# Altium schematic sheet Controller.SchDoc
size A4; SheetNumber: 6; SheetTotal: 6
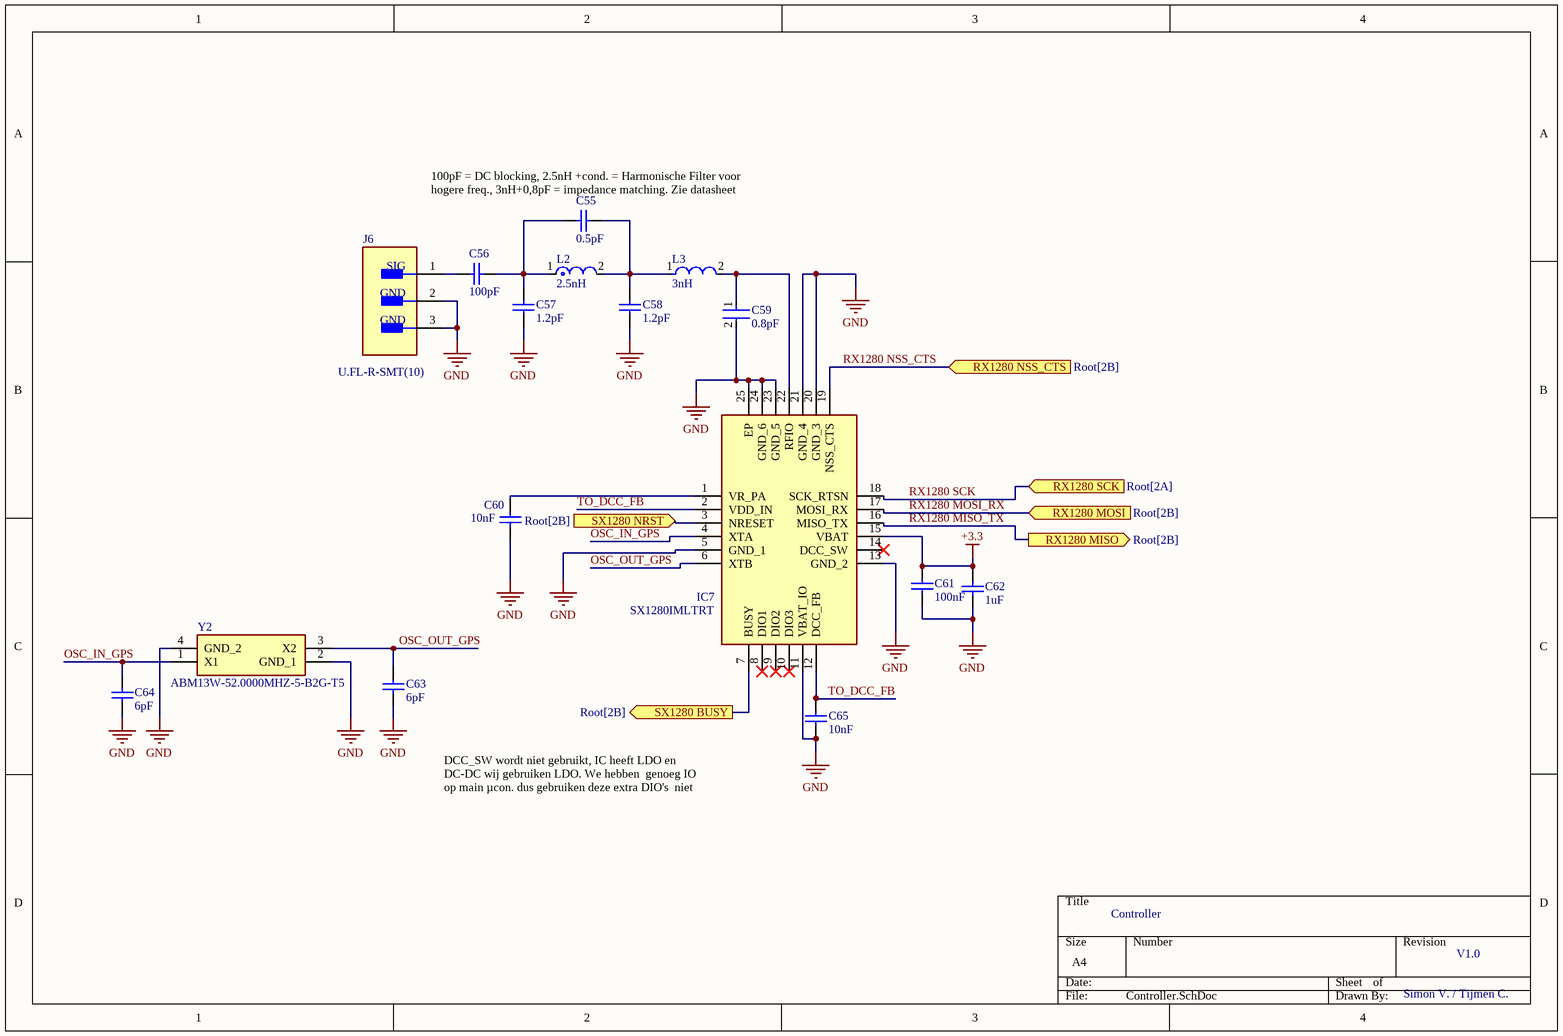
[diagram p0: Controller.SchDoc]

## Parts
C55  0.5pF  [CAPC0603(1608)100_M]
C56  100pF  [CAPC1608X92X38NL15T08]
C57  1.2pF  [CAPC1608X90X35NL15T15]
C58  1.2pF  [CAPC1608X90X35NL15T15]
C59  0.8pF  [FP-GCM188-0_1-IPC_C]
C60  10nF  [CAPC1608X92X38LL15T08]
C61  100nF  [CAPC1608X92X38ML15T08]
C62  1uF  [CAPC1608X90X35NL15T15]
C63  6pF  [CAPC1608X90X35ML15T15]
C64  6pF  [CAPC1608X90X35ML15T15]
C65  10nF  [CAPC1608X92X38LL15T08]
IC7  SX1280IMLTRT  [QFN50P400X400X100-25N-D]
J6  U.FL-R-SMT(10)  [FP-U_FL-R-SMT_10-MFG]
L2  2.5nH  [FP-LQP03TG_02-IPC_A]
L3  3nH  [FP-LQW18AN_80-MFG]
Y2  ABM13W-52.0000MHZ-5-B2G-T5  [ABM13W]

## Ports
RX1280 MISO (out, see Root[2B]), RX1280 MOSI (in, see Root[2B]), RX1280 NSS_CTS (in, see Root[2B]), RX1280 SCK (in, see Root[2A]), SX1280 BUSY (out, see Root[2B]), SX1280 NRST (in, see Root[2B])

## Nets
+3.3: C61.2 C62.2 IC7.15(VBAT)
GND: C57.1 C58.1 C59.2 C60.1 C61.1 C62.1 C63.1 C64.1 C65.1 IC7.5(GND_1) IC7.11(VBAT_IO) IC7.13(GND_2) IC7.20(GND_3) IC7.21(GND_4) IC7.23(GND_5) IC7.24(GND_6) IC7.25(EP) J6.2(GND) J6.3(GND) Y2.2(GND_1) Y2.4(GND_2)
OSC_IN_GPS: C64.2 IC7.4(XTA) Y2.1(X1)
OSC_OUT_GPS: C63.2 IC7.6(XTB) Y2.3(X2)
RX1280 MISO_TX: IC7.16(MISO_TX) ; port RX1280 MISO
RX1280 MOSI_RX: IC7.17(MOSI_RX) ; port RX1280 MOSI
RX1280 NSS_CTS: IC7.19(NSS_CTS) ; port RX1280 NSS_CTS
RX1280 SCK: IC7.18(SCK_RTSN) ; port RX1280 SCK
SX1280 BUSY: IC7.7(BUSY) ; port SX1280 BUSY
SX1280 NRST: IC7.3(NRESET) ; port SX1280 NRST
TO_DCC_FB: C65.2 IC7.2(VDD_IN) IC7.12(DCC_FB)
NetC55_1: C55.1 C56.2 C57.2 L2.1
NetC55_2: C55.2 C58.2 L2.2 L3.1
NetC56_1: C56.1 J6.1(SIG)
NetC59_1: C59.1 IC7.22(RFIO) L3.2
NetC60_2: C60.2 IC7.1(VR_PA)

Not connected (* = marked no-connect by the designer): IC7 8(DIO1)* 9(DIO2)* 10(DIO3)* 14(DCC_SW)*

## Notes on the sheet
- (near C55) 100pF = DC blocking, 2.5nH +cond. = Harmonische Filter voor hogere freq., 3nH+0,8pF = impedance matching. Zie datasheet
- DCC_SW wordt niet gebruikt, IC heeft LDO en  DC-DC wij gebruiken LDO. We hebben  genoeg IO op main µcon. dus gebruiken deze extra DIO's  niet
- Controller
- V1.0
- Simon V. / Tijmen C.

## Library data of the parts
C55 = CMP-1035-00001-1: CAP 0.5pF 10V ±0.1pF 0603 (1608 Metric) Thickness 1mm SMD; Case-EIA: 0603; Case-Metric: 1608; Tolerance: Â±0.1pF; Max Thickness: 1 mm; Value: 0.5pF; Technology: SMT; Rated Voltage: 10 V
C56 = CMP-2006-01145-1: Manufacturer: Vitramon; Part Number: VJ0603A101KXCAC
C57 C58 = CMP-2006-04009-1: Manufacturer: AVX Interconnect / Elco; Part Number: 06031A1R2CAT2A
C59 = CMP-06035-009191-1: Ceramic Capacitor for Automotive 0.8pF  ±0.1pF 100VDC C0G 0603 Paper T/R
C60 C65 = CMP-2006-01201-1: Manufacturer: Vitramon; Part Number: VJ0603Y103JXXAC
C61 = CMP-2006-01140-1: Part Number: VJ0603Y104MXXAC; Manufacturer: Vitramon
C62 = CMP-2006-04534-1: Part Number: 0603YD105MAT2A; Manufacturer: AVX Interconnect / Elco
C63 C64 = CMP-2006-04052-1: Part Number: 06031A5R0CAT2A; Manufacturer: AVX Interconnect / Elco
IC7 = SX1280IMLTRT: Integrated Circuit; Manufacturer_Name: SEMTECH; Datasheet Link: https://datasheet.datasheetarchive.com/originals/distributors/DKDS-37/728740.pdf; Height: 1mm; Manufacturer_Part_Number: SX1280IMLTRT; Mouser Part Number: 947-SX1280IMLTRT; Mouser Price/Stock: https://www.mouser.co.uk/ProductDetail/Semtech/SX1280IMLTRT?qs=5aG0NVq1C4xuoq8G6ZzdxQ%3D%3D; Arrow Part Number: SX1280IMLTRT; Arrow Price/Stock: https://www.arrow.com/en/products/sx1280imltrt/semtech?utm_currency=USD&region=nac
J6 = CMP-0029-00003-2: CONN U.FL RCPT STR 50 OHM SMD; Plating: Silver; Connector Type: Coaxial; Frequency: 6GHz; Impedance: 50R; Body Material: Bronze; Dielectric Material: Polymer; Contact Plating: Gold; Termination: Solder; Orientation: Vertical; Contact Material: Brass; Min Operating Temperature: -40°C; Mount: Surface Mount; Lead Free: Lead Free; Max Operating Temperature: 90°C; Radiation Hardening: No; Packaging: Tape and Reel; Body Plating: Silver; Fastening Type: Snap; Max Frequency: 6GHz; Depth: 3.1mm; Package Quantity: 1; Case/Package: SMD/SMT; Housing Color: Beige; Length: 3mm
L2 = CMP-06042-004686-1: Film type RF Inductor 2.5nH ±0.1nH 500mA 0.2Ω 0201 (0603); Self Resonant Frequency: 10GHz; Shielding: Unshielded; Core Material: Non-Magnetic; Test Frequency: 500MHz; Q Factor: 14; DC Resistance (DCR): 200mR; Package Quantity: 15000; Resistor Type: Thin Film; Max DC Current: 500mA; Lead Free: Lead Free; Packaging: Tape and Reel; Height - Seated (Max): 0.013inch; Inductance: 2.5nH; Width: 0.012inch; Termination: SMD/SMT; Case Code (Imperial): 0201; Mount: Surface Mount; Max Operating Temperature: 125°C; Height: 0.3mm; Min Operating Temperature: -55°C; Case Code (Metric): 0603; Length: 0.024inch; Current Rating: 500mA; Case/Package: 0201
L3 = CMP-06042-001485-1: Wire Wound RF Inductor 3nH ±0.2nH 670mA 0.17Ω 0603 (1608); Shielding: Unshielded; Core Material: Non-Magnetic; DC Resistance (DCR): 170mR; Self Resonant Frequency: 15GHz; Test Frequency: 100MHz; Q Factor: 13; Packaging: Tape and Reel; Case Code (Imperial): 0603; Case Code (Metric): 1608; Length: 0.065inch; Min Operating Temperature: -55°C; Height - Seated (Max): 0.039inch; Current Rating: 670mA; Case/Package: 0603; Resistor Type: Wirewound; Weight: 7.1E-05oz; Max Operating Temperature: 125°C; Max DC Current: 670mA; Package Quantity: 4000; Inductance: 3nH; Width: 0.99mm; Mount: Surface Mount; Height: 0.9mm; Termination: SMD/SMT
Y2 = ABM13W-52.0000MHZ-5-B2G-T5: Crystal or Oscillator; Manufacturer_Name: ABRACON; Datasheet Link: https://abracon.com/datasheets/ABM13W.pdf; Height: 0.33mm; Manufacturer_Part_Number: ABM13W-52.0000MHZ-5-B2G-T5; Mouser Part Number: 815-13W52-5-B2GT; Mouser Price/Stock: https://www.mouser.co.uk/ProductDetail/ABRACON/ABM13W-520000MHZ-5-B2G-T5?qs=qSfuJ%252Bfl%2Fd5s5ep7evyC%2Fg%3D%3D; Arrow Part Number: ABM13W-52.0000MHZ-5-B2G-T5; Arrow Price/Stock: https://www.arrow.com/en/products/abm13w-52.0000mhz-5-b2g-t5/abracon